# EAGLE schematic sp_esquematico (EAGLE 7.2.0)
CDESIGNER: Apellido, Nombre; CNAME: SENSOR DE PROXIMIDAD; CREVISION: 1.0; CSCHO: ESCUELA
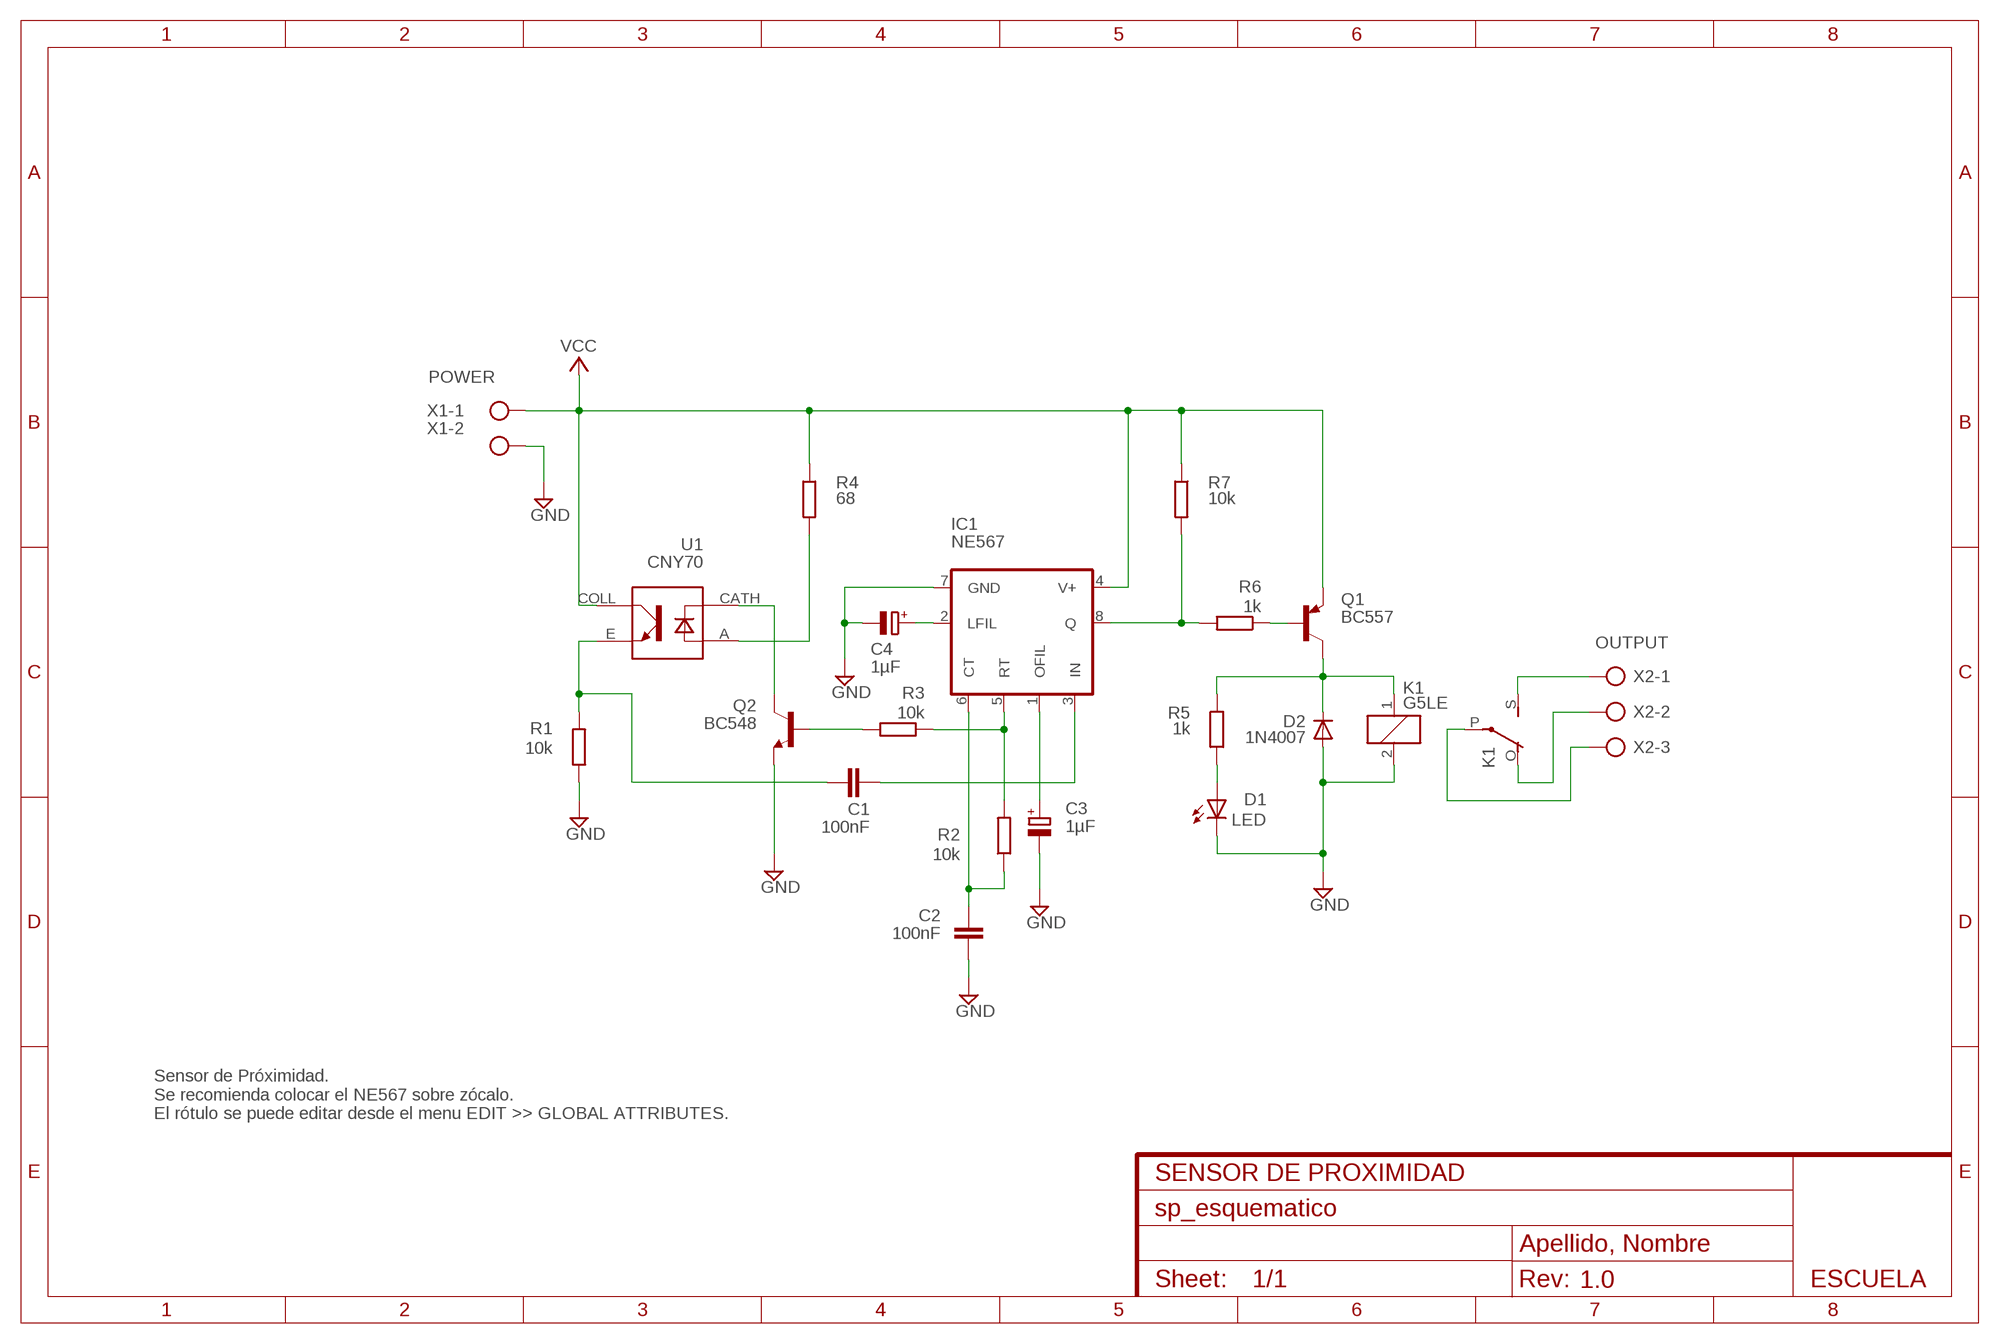
[diagram p0: schematic, sheet 1]

## Parts
C1  100nF  C-EU025-025X050  [C025-025X050]
C2  100nF  C-EU025-025X050  [C025-025X050]
C3  1µF  CPOL-EUE2.5-6  [E2,5-6]
C4  1µF  CPOL-EUE2.5-6  [E2,5-6]
D1  LED  LED3MM  [LED_3MM]
D2  1N4007  [DO41-10]
IC1  NE567  NE567NEN  [DIL08]
K1  G5LE  RELE_G5LE  [G5LE]
Q1  BC557  [TO92-EBC]
Q2  BC548  [TO92-EBC]
R1  10k  RESISTOR-EU0204/7  [0204/7]
R2  10k  RESISTOR-EU0204/7  [0204/7]
R3  10k  RESISTOR-EU0204/7  [0204/7]
R4  68  RESISTOR-EU0204/7  [0204/7]
R5  1k  RESISTOR-EU0204/7  [0204/7]
R6  1k  RESISTOR-EU0204/7  [0204/7]
R7  10k  RESISTOR-EU0204/7  [0204/7]
U1  CNY70  [DIPS254W50P254L710H600Q4]
X1  POWER  BORNERA_AK500/2  [AK500/2]
X2  OUTPUT  BORNERA_AK500/3  [AK500/3]

## Nets
GND: C2.2 C3.- C4.- D1.K(C) D2.A IC1.7(GND) K1.2 Q2.E R1.1 X1.2
N$1: C2.1 IC1.6(CT) R2.1
N$2: Q1.B R6.1
N$3: C4.+ IC1.2(LFIL)
N$4: IC1.8(Q) R6.2 R7.2
N$5: D1.A R5.2
N$6: Q2.C U1.CATH
N$7: D2.C K1.1 Q1.C R5.1
N$8: IC1.5(RT) R2.2 R3.1
N$9: C3.+ IC1.1(OFIL)
N$10: C1.2 IC1.3(IN)
N$11: Q2.B R3.2
N$12: R4.2 U1.A
N$13: C1.1 R1.2 U1.E
N$14: K1.S(2:NA) X2.1
N$15: K1.O(2:NC) X2.2
N$16: K1.P(2:COM) X2.3
VCC: IC1.4(V+) Q1.E R4.1 R7.1 U1.COLL X1.1

## Notes on the sheet
- Sensor de Próximidad.
  Se recomienda colocar el NE567 sobre zócalo.
  El rótulo se puede editar desde el menu EDIT >> GLOBAL ATTRIBUTES.

## Library data of the parts
C1 C2 = rcl:C-EU: CAPACITOR, European symbol
C3 C4 = rcl:CPOL-EU: POLARIZED CAPACITOR, European symbol
D1 = treser_lib:LED: LEDs
D2 = treser_lib:1N4007: Diodo Rectificador Rectificador de proposito general 1N400x.
IC1 = treser_lib:NE567: NE567 Decodificador de tonos.
K1 = treser_lib:RELE_G5LE: Relé Simple Inversor 1 x Switch, 10 A/120 V AC, 8 A/30 V DC, Omron.; OC_FARNELL: unknown; OC_NEWARK: unknown
Q1 = treser_lib:BC557*: BC557 Transistor PNP.
Q2 = treser_lib:BC548: Transistor NPN
R1-R7 = treser_lib:RESISTOR-EU: Resistor Simbolo europeo.
U1 = treser_lib:CNY70: CNY70 Series 1 mA 1.25 V 950 nm 200 mW Reflective Optical Sensor 4 Pin.; AVAILABILITY: In Stock; CHECK_PRICES: https://www.snapeda.com/parts/CNY70/Vishay+Semiconductor+Opto+Division/view-part/?ref=eda; DESCRIPTION: Reflective Optical Sensor 0.197 (5mm) PCB Mount; MF: Vishay; MP: CNY70; PACKAGE: PCB Mount Vishay; PRICE: None; PURCHASE-URL: https://www.snapeda.com/api/url_track_click_mouser/?unipart_id=230090&manufacturer=Vishay&part_name=CNY70&search_term=None; SNAPEDA_LINK: https://www.snapeda.com/parts/CNY70/Vishay+Semiconductor+Opto+Division/view-part/?ref=snap
X1 = treser_lib:BORNERA_AK500/2: Bornera de tornillo; OC_FARNELL: unknown; OC_NEWARK: unknown
X2 = treser_lib:BORNERA_AK500/3: Bornera de tornillo; OC_FARNELL: unknown; OC_NEWARK: unknown